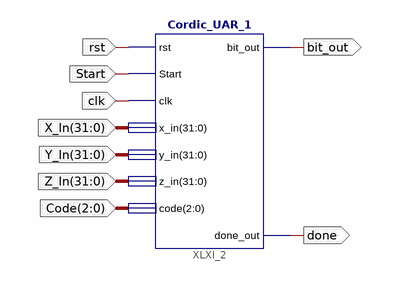
[diagram p0: schematic sheet 1]
// Xilinx ISE schematic Schematic.sch (spartan3e) as structural Verilog: 1 symbols, 9 ports
module Schematic (
  input  rst,
  input  Start,
  input  clk,
  input  [31:0] X_In,
  input  [31:0] Y_In,
  input  [31:0] Z_In,
  input  [2:0] Code,
  output bit_out,
  output done
);

  Cordic_UAR_1 XLXI_2 (
    .rst(rst), .Start(Start), .clk(clk), .x_in(X_In), .y_in(Y_In), .z_in(Z_In), .code(Code),
    .bit_out(bit_out), .done_out(done));
endmodule
